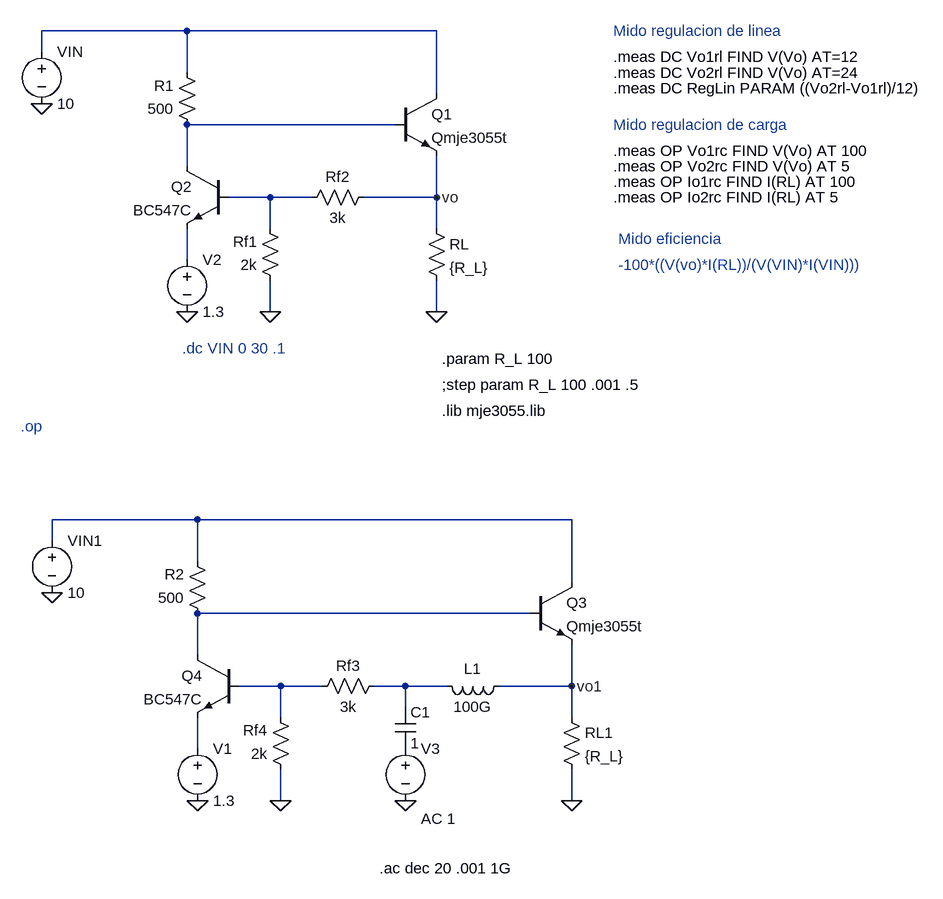
[diagram p0: schematic primer_check.asc]
primer_check.asc, the LTspice schematic file:
Version 4.1
SHEET 1 1076 1272
WIRE -96 -32 -320 -32
WIRE 288 -32 -96 -32
WIRE -320 0 -320 -32
WIRE -96 32 -96 -32
WIRE 288 64 288 -32
WIRE 224 112 -96 112
WIRE -96 176 -96 112
WIRE 32 224 -32 224
WIRE 96 224 32 224
WIRE 288 224 288 160
WIRE 288 224 176 224
WIRE 32 272 32 224
WIRE 288 272 288 224
WIRE -96 320 -96 272
WIRE 32 400 32 352
WIRE 288 400 288 352
WIRE -80 720 -304 720
WIRE 496 720 -80 720
WIRE -304 752 -304 720
WIRE -80 784 -80 720
WIRE 496 816 496 720
WIRE 432 864 -80 864
WIRE -80 928 -80 864
WIRE 48 976 -16 976
WIRE 112 976 48 976
WIRE 240 976 192 976
WIRE 304 976 240 976
WIRE 496 976 496 912
WIRE 496 976 384 976
WIRE 240 1008 240 976
WIRE 48 1024 48 976
WIRE 496 1024 496 976
WIRE -80 1072 -80 1024
WIRE 48 1152 48 1104
WIRE 496 1152 496 1104
FLAG -320 80 0
FLAG -96 400 0
FLAG 288 400 0
FLAG 32 400 0
FLAG 288 224 vo
FLAG -304 832 0
FLAG -80 1152 0
FLAG 496 1152 0
FLAG 48 1152 0
FLAG 496 976 vo1
FLAG 240 1152 0
SYMBOL npn 224 64 R0
SYMATTR InstName Q1
SYMATTR Value Qmje3055t
SYMBOL npn -32 176 M0
SYMATTR InstName Q2
SYMATTR Value BC547C
SYMBOL res 272 256 R0
SYMATTR InstName RL
SYMATTR Value {R_L}
SYMBOL res 192 208 R90
WINDOW 0 0 56 VBottom 2
WINDOW 3 32 56 VTop 2
SYMATTR InstName Rf2
SYMATTR Value 3k
SYMBOL res 48 368 R180
WINDOW 0 36 76 Left 2
WINDOW 3 36 40 Left 2
SYMATTR InstName Rf1
SYMATTR Value 2k
SYMBOL res -80 128 R180
WINDOW 0 36 76 Left 2
WINDOW 3 36 40 Left 2
SYMATTR InstName R1
SYMATTR Value 500
SYMBOL voltage -320 -16 R0
WINDOW 123 0 0 Left 0
WINDOW 39 0 0 Left 0
SYMATTR InstName VIN
SYMATTR Value 10
SYMBOL voltage -96 304 R0
WINDOW 123 0 0 Left 0
WINDOW 39 0 0 Left 0
SYMATTR InstName V2
SYMATTR Value 1.3
SYMBOL npn 432 816 R0
SYMATTR InstName Q3
SYMATTR Value Qmje3055t
SYMBOL npn -16 928 M0
SYMATTR InstName Q4
SYMATTR Value BC547C
SYMBOL res 480 1008 R0
SYMATTR InstName RL1
SYMATTR Value {R_L}
SYMBOL res 208 960 R90
WINDOW 0 0 56 VBottom 2
WINDOW 3 32 56 VTop 2
SYMATTR InstName Rf3
SYMATTR Value 3k
SYMBOL res 64 1120 R180
WINDOW 0 36 76 Left 2
WINDOW 3 36 40 Left 2
SYMATTR InstName Rf4
SYMATTR Value 2k
SYMBOL res -64 880 R180
WINDOW 0 36 76 Left 2
WINDOW 3 36 40 Left 2
SYMATTR InstName R2
SYMATTR Value 500
SYMBOL voltage -304 736 R0
WINDOW 123 0 0 Left 0
WINDOW 39 0 0 Left 0
SYMATTR InstName VIN1
SYMATTR Value 10
SYMBOL voltage -80 1056 R0
WINDOW 123 0 0 Left 0
WINDOW 39 0 0 Left 0
SYMATTR InstName V1
SYMATTR Value 1.3
SYMBOL ind 400 960 R90
WINDOW 0 5 56 VBottom 2
WINDOW 3 32 56 VTop 2
SYMATTR InstName L1
SYMATTR Value 100G
SYMBOL cap 224 1008 R0
SYMATTR InstName C1
SYMATTR Value 1
SYMBOL voltage 240 1056 R0
WINDOW 123 24 124 Left 2
WINDOW 39 0 0 Left 0
SYMATTR InstName V3
SYMATTR Value ""
SYMATTR Value2 AC 1
TEXT 296 472 Left 2 !.param R_L 100
TEXT 296 512 Left 2 !;step param R_L 100 .001 .5
TEXT 296 552 Left 2 !.lib mje3055.lib
TEXT -352 576 Left 2 ;.op
TEXT -104 456 Left 2 ;.dc VIN 0 30 .1
TEXT 560 -32 Left 2 ;Mido regulacion de linea
TEXT 560 8 Left 2 !.meas DC Vo1rl FIND V(Vo) AT=12
TEXT 560 32 Left 2 !.meas DC Vo2rl FIND V(Vo) AT=24
TEXT 560 56 Left 2 !.meas DC RegLin PARAM ((Vo2rl-Vo1rl)/12)
TEXT 560 112 Left 2 ;Mido regulacion de carga
TEXT 560 152 Left 2 !.meas OP Vo1rc FIND V(Vo) AT 100
TEXT 560 176 Left 2 !.meas OP Vo2rc FIND V(Vo) AT 5
TEXT 560 200 Left 2 !.meas OP Io1rc FIND I(RL) AT 100
TEXT 560 224 Left 2 !.meas OP Io2rc FIND I(RL) AT 5
TEXT 568 288 Left 2 ;Mido eficiencia
TEXT 568 328 Left 2 ;-100*((V(vo)*I(RL))/(V(VIN)*I(VIN)))
TEXT 200 1256 Left 2 !.ac dec 20 .001 1G

The netlist it stands for:
* primer_check.asc
Q1 N001 N002 vo 0 Qmje3055t
Q2 N002 N003 N004 0 BC547C
RL vo 0 {R_L}
Rf2 vo N003 3k
Rf1 0 N003 2k
R1 N002 N001 500
VIN N001 0 10
V2 N004 0 1.3
Q3 N005 N006 vo1 0 Qmje3055t
Q4 N006 N007 N009 0 BC547C
RL1 vo1 0 {R_L}
Rf3 N008 N007 3k
Rf4 0 N007 2k
R2 N006 N005 500
VIN1 N005 0 10
V1 N009 0 1.3
L1 vo1 N008 100G
C1 N008 P001 1
V3 P001 0 AC 1
.model NPN NPN
.model PNP PNP
.lib standard.bjt
.param R_L 100
;step param R_L 100 .001 .5
.lib mje3055.lib
* .op
* .dc VIN 0 30 .1
* Mido regulacion de linea
.meas DC Vo1rl FIND V(Vo) AT=12
.meas DC Vo2rl FIND V(Vo) AT=24
.meas DC RegLin PARAM ((Vo2rl-Vo1rl)/12)
* Mido regulacion de carga
.meas OP Vo1rc FIND V(Vo) AT 100
.meas OP Vo2rc FIND V(Vo) AT 5
.meas OP Io1rc FIND I(RL) AT 100
.meas OP Io2rc FIND I(RL) AT 5
* Mido eficiencia
* -100*((V(vo)*I(RL))/(V(VIN)*I(VIN)))
.ac dec 20 .001 1G
.backanno
.end